# Altium project CW Oscillator.PrjPcb
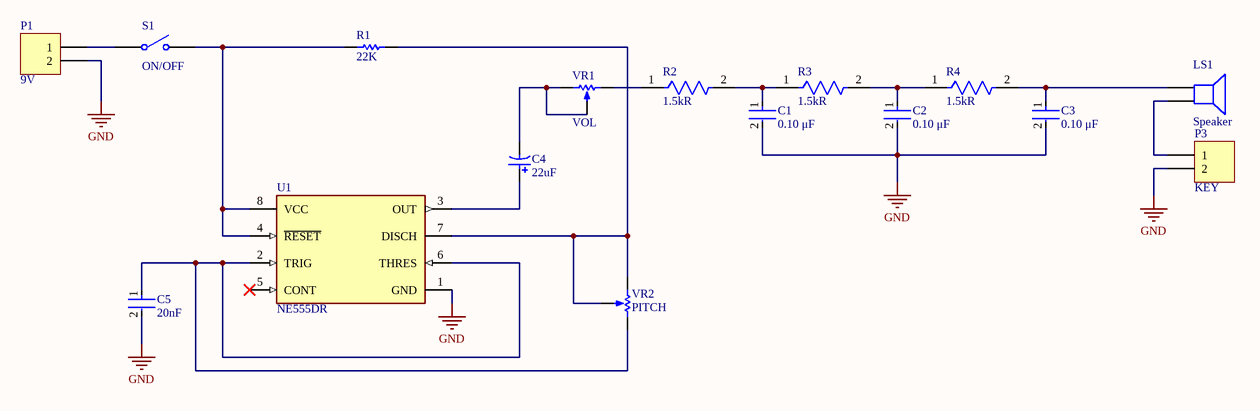
[diagram p0: CW-Oscillator.SchDoc]
1 sheet, 16 parts. Net scope: global (net labels, ports and power ports of the same name join across sheets).
Board file: PCB.PcbDoc

## Sheet CW-Oscillator.SchDoc
size A4

### Parts
C1  0.10 μF  [FP-C0805C-DN-MFG]
C2  0.10 μF  [FP-C0805C-DN-MFG]
C3  0.10 μF  [FP-C0805C-DN-MFG]
C4  22uF  [CAPPR55-200-1100X500X1200]
C5  20nF  [FP-GRM21B-0_1-IPC_B]
LS1  Speaker  [PIN2]
P1  9V  [HDR1X2]
P3  KEY  [HDR1X2]
R1  22K  [RESA60-630X240]
R2  1.5kR  [FP-ERJ6EN-MFG]
R3  1.5kR  [FP-ERJ6EN-MFG]
R4  1.5kR  [FP-ERJ6EN-MFG]
S1  ON/OFF  [SPST-2]
U1  NE555DR  [FP-D0008A-IPC_A]
VR1  VOL  [BOUR-3362P]
VR2  PITCH  [BOUR-3362P]

### Nets
GND: C1.2 C2.2 C3.2 C5.2 P1.2 P3.2 U1.1(GND)
NetC1_1: C1.1 R2.2 R3.1
NetC2_1: C2.1 R3.2 R4.1
NetC3_1: C3.1 LS1.1 R4.2
NetC4_1: C4.1 U1.3(OUT)
NetC4_2: C4.2 VR1.1(CCW) VR1.2(S)
NetC5_1: C5.1 U1.2(TRIG) U1.6(THRES) VR2.3(CW)
NetLS1_2: LS1.2 P3.1
NetP1_1: P1.1 S1.1(COMMON)
NetR1_1: R1.1 U1.7(DISCH) VR2.1(CCW) VR2.2(S)
NetR1_2: R1.2 S1.2(NO) U1.4(~{RESET}) U1.8(VCC)
NetR2_1: R2.1 VR1.3(CW)

Not connected (* = marked no-connect by the designer): U1 5(CONT)*

### Library data of the parts
C1-C3 = CMP-2007-00279-2: CAP CER 0.1UF 50V X7R 0805; Manufacturer Part Number: C0805C104K5RACTU; Manufacturer: KEMET; Tolerance: 0.1; Temperature Coefficient: 30ppm/°C; Material: Ceramic; Device Class L2: Capacitors; Temperature Range Low: -55°C; Voltage Rating: 50 V; Digikey Description: CAP CER 0.1UF 50V X7R 0805; Value: 0.10 μF; Category: Cap; ComponentLink2Description: Datasheet; Octopart: https://octopart.com/c0805c104k5ractu-kemet-143926; RoHS: TRUE; ComponentLink2URL: https://content.kemet.com/datasheets/KEM_C1003_C0G_SMD.pdf; Temperature Characteristic: X7R; Temperature: -55°C to +125°C; Height: 0.88mm; Temperature Range High: +125°C; Device Class L1: Passive Components; Automotive: No; Lead Free: Yes; Ipc Land Pattern Name: CAPC200125X78; Device Class L3: Ceramic Capacitors; Mouser Description: Cap Ceramic 0.1uF 50V X7R 10% SMD 2.0 x 1.2 mm 125 C Paper T/R; Capacitance: 0.10 μF; Package: C0805C-DN
C4 = CMP-1665-00036-2: Aluminum Electrolytic Capacitor, 22 uF, +/- 20%, 50 V, -40 to 85 degC, 2-Pin THD, RoHS, Bulk; Manufacturer: Panasonic; Ripple Current: 100mA; Life (Hours): 2000Hour; Voltage: 50V; Dissipation Factor: 0.12%; Leakage Current: 3uA; Lead/Base Style: Straight; Lead Diameter: 0.5mm; Max Operating Temperature: 85degC; Height: 11mm; Package Reference: CAPPR55-200-1100X500X1200; Radiation Hardening: No; RoHSCompliant: true; Termination: Radial; Case/Package: Radial; REACH SVHC: NoSVHC; Height - Seated (Max): 0.472inch; Min Operating Temperature: -40degC; Packaging: Bulk; Manufacturer URL: http://www.panasonic.com/; Length: 11mm; Tolerance: 20%; Voltage Rating: 50V; Voltage Rating (DC): 50V; Datasheet URL: https://industrial.panasonic.com/cdbs/www-data/pdf/RDF0000/ABA0000C1218.pdf; Lead Pitch: 2mm; Ripple Current (AC): 100mA; Package Description: 2-Pin Radial Lead, Dia 5 mm, Height 12 mm; Diameter: 5mm; Capacitance: 22uF; Datasheet Version: Rev. 05, 10/2016; Package Quantity: 200; Mount: ThroughHole
C5 = CMP-2007-03469-2: Chip Multilayer Ceramic Capacitors for General Purpose, 0805, 20000pF, C0G, 30ppm/°C, 5%, 50V; Height: 1.25mm; Thickness: 0.053inch; Dielectric: C0G; Mount: Surface Mount; Package Quantity: 3000; Max Operating Temperature: 125°C; Voltage Rating: 50V; Depth: 1.25mm; Termination: SMD/SMT; Width: 0.049inch; Voltage Rating (DC): 50V; Capacitance: 20nF; Lead Free: Lead Free; Min Operating Temperature: -55°C; Tolerance: 5%; Case/Package: 0805; Case Code (Metric): 2012; Packaging: Tape and Reel; Radiation Hardening: No; Length: 2mm; Case Code (Imperial): 0805
LS1 = Speaker: Loudspeaker; Published: 24-Mar-1999; LatestRevisionDate: 17-Jul-2002; LatestRevisionNote: Re-released for DXP Platform.; PackageReference: PIN2; Publisher: Altium Limited
P1 P3 = Header 2: Header, 2-Pin; LatestRevisionDate: 17-Jul-2002; LatestRevisionNote: Re-released for DXP Platform.; Publisher: Altium Limited
R1 = CMP-1659-00062-1: Axial Resistor, 22.1 KOhm, +/- 1%, 0.25 W, -55 to 155 degC, 2-Pin THD, RoHS, Bulk; Case\Package: 1008; Current Rating: 1.5 A; Shielding: Shielded; Tolerance: 20%; Radiation Hardening: No; Length: 2.5 mm; ComponentLink1Description: Manufacturer URL; Max Operating Temperature: 85 degC; ComponentLink2URL: http://www.yageo.com/documents/recent/Yageo%20LR_MFR_2013.pdf; Height: 1.1 mm; Packaging: Tape and Reel; Package Quantity: 3000; Min Operating Temperature: -40 degC; DatasheetVersion: Apr-13; Resistance: 22K; RoHSCompliant: true; ComponentLink2Description: Datasheet; PackageReference: MFR-25; PackageDescription: 2-Pin Axial Lead, Dia 2.4 mm, Body Length 6.3 mm; Width: 2 mm; Mount: Surface Mount; ComponentLink1URL: http://www.yageo.com/; Case Code (Metric): 2520
R2-R4 = CMP-2001-04438-5: RES SMD 1.5K OHM 1% 1/8W 0805; Power Rating: 125mW; Temperature Coefficient: 100ppm/°C; Voltage Rating: 150V; Max Operating Temperature: 155°C; Number of Terminations: 2; Resistance Tolerance: 1%; Size Code: 0805; Case/Package: 0805; Features: Automotive AEC-Q200; Reach SVHC Compliant: Yes; RoHS Compliant: Yes; Mount: Surface Mount; Resistance: 1.5kR; Military Standard: Not; Depth: 1.25mm; Number of Pins: 2; Height: 0.6mm; Case Code (Metric): 2012; Technology: THICK FILM; Radiation Hardening: No; Max Power Dissipation: 125mW; Min Operating Temperature: -55°C; Case Code (Imperial): 0805; Construction: Rectangular; Lead Free: Lead Free; Series: ERJ; Width: 1.2mm; Termination: SMD/SMT; Contact Plating: Tin; Package Quantity: 1; Voltage Rating (DC): 150V; Tolerance: 1%; Length: 2mm; Packaging: Tape and Reel; Resistor Type: Thick Film
S1 = SW-SPST: Single-Pole, Single-Throw Switch; Published: 24-Mar-1999; LatestRevisionDate: 17-Jul-2002; LatestRevisionNote: Re-released for DXP Platform.; PackageReference: SPST-2; Publisher: Altium Limited; PackageDescription: Switch; 2 Leads
U1 = CMP-1685-00007-2: IC OSC SGL TIMER 100KHZ 8-SOIC; Low Level Output Current: 200mA; Quiescent Current: 15mA; Min Supply Voltage: 4.5V; Number of Timers/Counters: 1; Max Supply Voltage: 16V; Operating Supply Current: 10mA; High Level Output Current: -200mA; Packaging: Tape and Reel; Frequency: 100kHz; Weight: 0.002561oz; REACH SVHC: No SVHC; Package Quantity: 2500; Width: 3.91mm; Max Operating Temperature: 70°C; Contact Plating: Gold; Lead Free: Lead Free; Number of Pins: 8; Min Operating Temperature: 0°C; Radiation Hardening: No; Length: 4.9mm; Case/Package: SOIC; Height: 1.58mm; Mount: Surface Mount
VR1 = CMP-1747-00004-1: Square Trimpot(R) Trimming Potentiometer, 10 KOhm, 300 V, -55 to 125 degC, 3-Pin THD, RoHS, Tube; Voltage Rating: 220 mV; Power Rating: 1 W; Tolerance: 1%; Resistance: 10k; Case/Package: 1206; Length: 3.2 mm; RoHSCompliant: True; PackageDescription: 3-Pin Through Hole Device, Body 6.6 x 6.99 mm, Pitch 2.54 mm; ComponentLink2Description: Datasheet; REACH SVHC: No SVHC; Mount: Surface Mount; Height: 0.6 mm; Packaging: Tape and Reel; ComponentLink1URL: http://www.bourns.com/; Case Code (Imperial): 0612; Pins: 2; Case Code (Metric): 1632; ComponentLink2URL: http://www.bourns.com/docs/Product-Datasheets/3362.pdf; Min Operating Temperature: -25degC; ComponentLink1Description: Manufacturer URL; PackageReference: 3326P; Max Operating Temperature: 125degC; Width: 1.6 mm; Package Quantity: 5000; DatasheetVersion: May-16
VR2 = CMP-1747-00003-1: Square Trimpot(R) Trimming Potentiometer, 100 KOhm, 300 V, -55 to 125 degC, 3-Pin THD, RoHS, Tube; Voltage Rating: 250 V; Case\Package: Axial; Tolerance: 1%; Power Rating: 250 mW; Resistance: 100K; RoHSCompliant: true; ComponentLink2URL: http://www.bourns.com/docs/Product-Datasheets/3362.pdf; ComponentLink1Description: Manufacturer URL; DatasheetVersion: May-16; Package Quantity: 200; ComponentLink2Description: Datasheet; Min Operating Temperature: -55 degC; Mount: Through Hole; PackageDescription: 3-Pin Through Hole Device, Body 6.6 x 6.99 mm, Pitch 2.54 mm; Length: 0.248 inch; ComponentLink1URL: http://www.bourns.com/; PackageReference: 3326P; Max Operating Temperature: 155 degC; Packaging: Bulk